# Altium schematic sheet mpc56_clk.SchDoc: Clock/Reset Drivers
size Letter; Organization: NewAE Technology Inc.; Address1: 1083 Queen St., Suite 196; Address2: Halifax; Address3: NS; Address4: Canada B3H 0B2; SheetNumber: 2; SheetTotal: 5; SheetApproved: YES
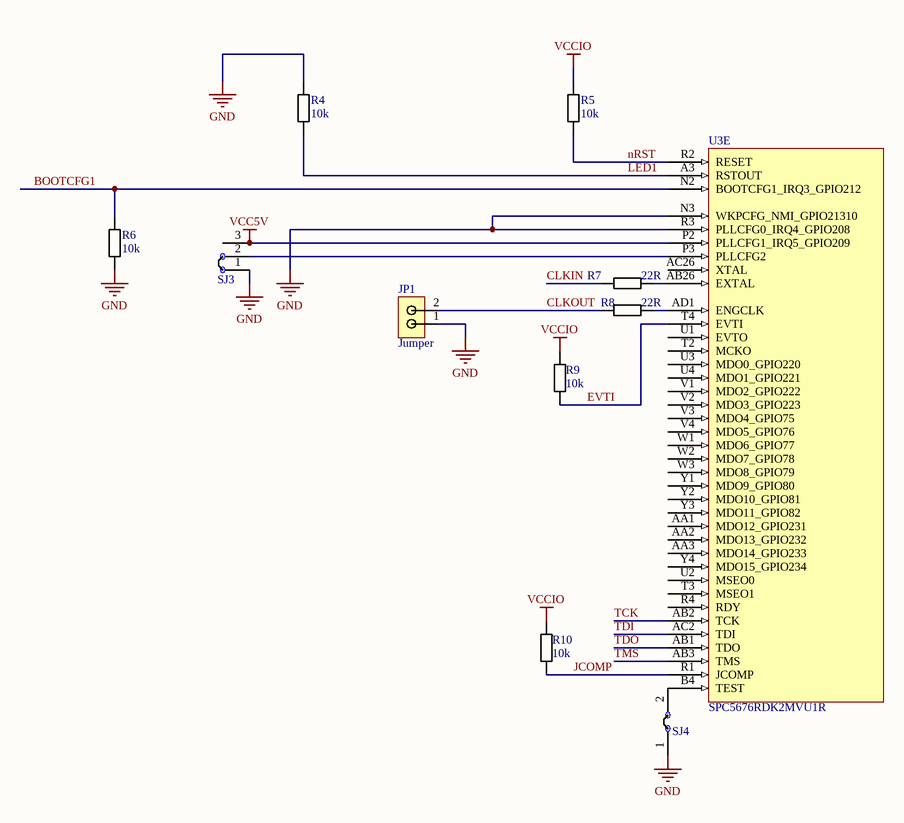
[diagram p0: mpc56_clk.SchDoc]

## Parts
JP1  Jumper  [2x2.54mm_Header]
R4  10k  [RESC1608X55N]
R5  10k  [RESC1608X55N]
R6  10k  [RESC1608X55N]
R7  22R  [RESC1608X55N]
R8  22R  [RESC1608X55N]
R9  10k  [RESC1608X55N]
R10  10k  [RESC1608X55N]
SJ3  NC  [SJ_3S_NC12]  (value not drawn)  (no BOM)
SJ4  NC  [SJ_2S_NC]  (value not drawn)  (no BOM)
U3  SPC5676RDK2MVU1R  [TEPBGA416_27x27]  (part E of 6)

## Nets
GND: JP1.1 R4.1 R6.2 SJ3.1 SJ4.1 U3.N3(WKPCFG_NMI_GPIO21310) U3.R3(PLLCFG0_IRQ4_GPIO208)
VCC5V: SJ3.3 U3.P2(PLLCFG1_IRQ5_GPIO209)
VCCIO: R5.1 R9.2 R10.1
BOOTCFG1: R6.1 U3.N2(BOOTCFG1_IRQ3_GPIO212)
CLKIN: R7.2
CLKOUT: JP1.2 R8.2
EVTI: R9.1 U3.T4(EVTI)
JCOMP: R10.2 U3.R1(JCOMP)
LED1: R4.2 U3.A3(RSTOUT)
nRST: R5.2 U3.R2(RESET)
TCK: U3.AB2(TCK)
TDI: U3.AC2(TDI)
TDO: U3.AB1(TDO)
TMS: U3.AB3(TMS)
NetR7_1: R7.1 U3.AB26(EXTAL)
NetR8_1: R8.1 U3.AD1(ENGCLK)
NetSJ3_2: SJ3.2 U3.P3(PLLCFG2)
NetSJ4_2: SJ4.2 U3.B4(TEST)

Not connected (* = marked no-connect by the designer): U3 AA1(MDO12_GPIO231) AA2(MDO13_GPIO232) AA3(MDO14_GPIO233) AC26(XTAL) R4(RDY) T2(MCKO) T3(MSEO1) U1(EVTO) U2(MSEO0) U3(MDO0_GPIO220) U4(MDO1_GPIO221) V1(MDO2_GPIO222) V2(MDO3_GPIO223) V3(MDO4_GPIO75) V4(MDO5_GPIO76) W1(MDO6_GPIO77) W2(MDO7_GPIO78) W3(MDO8_GPIO79) Y1(MDO9_GPIO80) Y2(MDO10_GPIO81) Y3(MDO11_GPIO82) Y4(MDO15_GPIO234)

## Notes on the sheet
- Title:
- Date:
- Rev:
- Time:
- Project:
- Sheet
- of
- License:
- Copyright © NewAE Technology Inc.
- Approved:
- NewAE.com
- File:

## Library data of the parts
JP1 = 2_PIN_JUMPER: 1x2 2.54mm header, male pins; Manufacture 1: Harwin; Manufacture Part Number 1: M20-9990246; Component Group: PCB Feature; PP Material Stack: 0; Part Number: 2_PIN_JUMPER; Pin Count: 2; Supplier 1: Digi-Key; Supplier Part Number 1: 952-2262-ND; Mounting Technology: Through-hole; RoHS: Yes; Component Kind: Standard; Component Type: Standard; PP Rotation: 0
R4-R6 R9 R10 = RCHIP-10K-0603: 10k res, 0603, 1%, 1/10W; Manufacture 1: Yageo; Manufacture Part Number 1: RC0603FR-0710KL; Case-EIA: 0603; Case-Metric: 1608; Rated Power: 0.1W; Rated Voltage: 75VDC; Part Number: RCHIP-10K-0603; Component Kind: Standard; Component Type: Standard; Footprint: 0603; Pin Count: 2; Supplier 1: Digi-Key; Supplier Part Number 1: 311-10.0KHRCT-ND; Value: 10k; Tolerance: 1%; Mounting Technology: SMT; Temperature Range: -55C to 155C
R7 R8 = RCHIP-22R-0603: 22R res, 0603, 1%, 1/10W; Manufacture 1: Yageo; Manufacture Part Number 1: RC0603FR-0722RL; Case-EIA: 0603; Case-Metric: 1608; Rated Power: 0.1W; Rated Voltage: 75VDC; Part Number: RCHIP-22R-0603; Component Kind: Standard; Component Type: Standard; Footprint: 0603; Pin Count: 2; Supplier 1: Digi-Key; Supplier Part Number 1: 311-22.0HRCT-ND; Value: 22R; Tolerance: 1%; Mounting Technology: SMT; Temperature Range: -55C to 155C
SJ3 = SJ_3S_12JMP: Solder Jumper, NC; Component Group: PCB Feature; Part Number: SJ_3S_12JMP; Pin Count: 3; Mounting Technology: COPPER; Component Type: Standard (No BOM)
SJ4 = SJ_2S: Solder Jumper, NC; Part Number: SJ_2S; Component Type: Standard (No BOM); Pin Count: 2
U3 = SPC5676RDK2MVU1R: Dual-Core PPC, Automotive; Manufacture 1: NXP; Component Group: Digital IC; PP Material Stack: 0; Part Number: SPC5676RDK2MVU1R; Manufacture Part Number 1: SPC5676RDK2MVU1R; Pin Count: 412; Supplier 1: Mouser; Mounting Technology: SMT; RoHS: Yes; Component Kind: Standard; Component Type: Standard; PP Rotation: 0